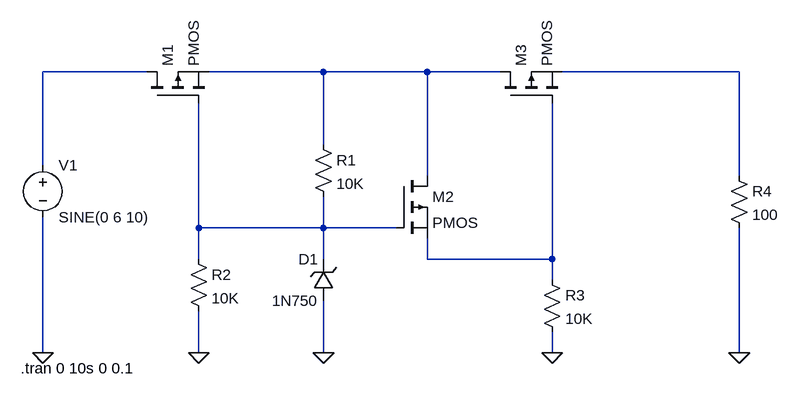
[diagram p0: schematic protection_circuit.asc]
protection_circuit.asc, the LTspice schematic file:
Version 4
SHEET 1 1700 680
WIRE 720 128 560 128
WIRE 992 128 816 128
WIRE 1152 128 992 128
WIRE 1264 128 1152 128
WIRE 1632 128 1360 128
WIRE 992 240 992 128
WIRE 560 272 560 128
WIRE 1152 288 1152 128
WIRE 1632 288 1632 128
WIRE 800 368 800 176
WIRE 992 368 992 320
WIRE 992 368 800 368
WIRE 1104 368 992 368
WIRE 800 416 800 368
WIRE 992 416 992 368
WIRE 1152 416 1152 384
WIRE 1344 416 1344 176
WIRE 1344 416 1152 416
WIRE 1344 448 1344 416
WIRE 560 560 560 352
WIRE 800 560 800 496
WIRE 992 560 992 480
WIRE 1344 560 1344 528
WIRE 1632 560 1632 368
FLAG 800 560 0
FLAG 992 560 0
FLAG 1344 560 0
FLAG 560 560 0
FLAG 1632 560 0
SYMBOL pmos 720 176 R270
SYMATTR InstName M1
SYMBOL pmos 1104 288 R0
SYMATTR InstName M2
SYMBOL pmos 1264 176 R270
SYMATTR InstName M3
SYMBOL zener 1008 480 R180
WINDOW 0 24 64 Left 2
WINDOW 3 24 0 Left 2
SYMATTR InstName D1
SYMATTR Value 1N750
SYMBOL res 976 224 R0
SYMATTR InstName R1
SYMATTR Value 10K
SYMBOL res 784 400 R0
SYMATTR InstName R2
SYMATTR Value 10K
SYMBOL res 1328 432 R0
SYMATTR InstName R3
SYMATTR Value 10K
SYMBOL voltage 560 256 R0
WINDOW 123 0 0 Left 0
WINDOW 39 0 0 Left 0
SYMATTR InstName V1
SYMATTR Value SINE(0 6 10)
SYMBOL res 1616 272 R0
SYMATTR InstName R4
SYMATTR Value 100
TEXT 526 584 Left 2 !.tran 0 10s 0 0.1

The netlist it stands for:
* protection_circuit.asc
M1 N001 N004 N002 N002 PMOS
M2 N002 N004 N005 N005 PMOS
M3 N002 N005 N003 N003 PMOS
D1 0 N004 1N750
R1 N002 N004 10K
R2 N004 0 10K
R3 N005 0 10K
V1 N001 0 SINE(0 6 10)
R4 N003 0 100
.model D D
.lib standard.dio
.model NMOS NMOS
.model PMOS PMOS
.lib standard.mos
.tran 0 10s 0 0.1
.backanno
.end